# EAGLE design power distribution board (EAGLE 8.3.1)
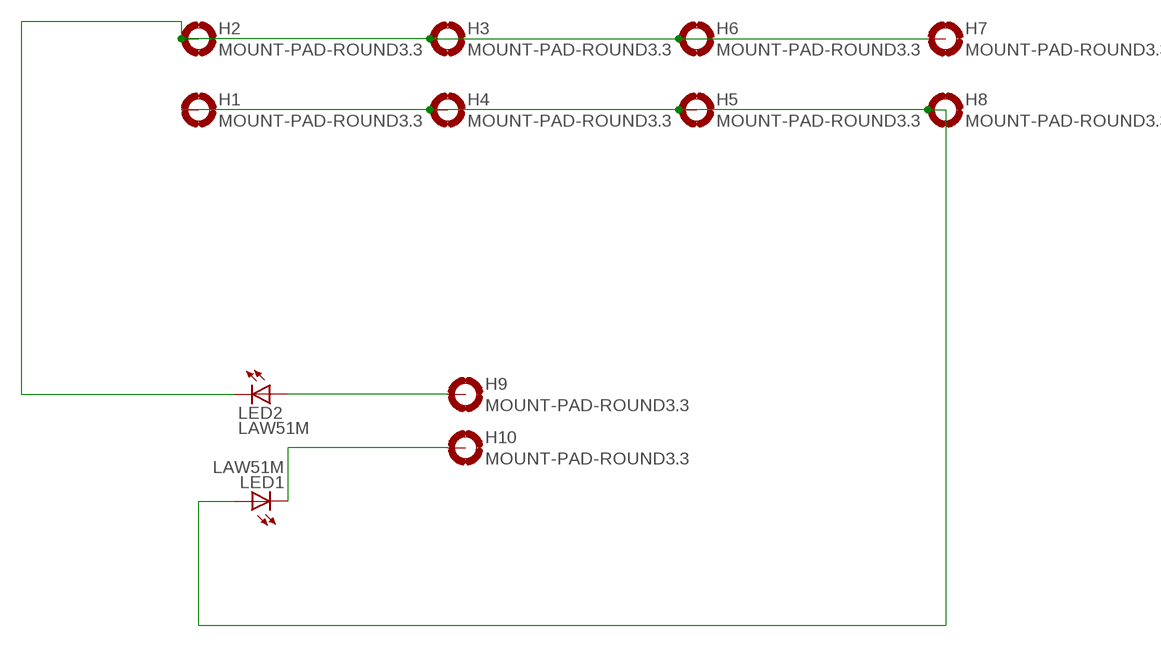
[diagram p0: schematic, sheet 1]

## Parts
H1  MOUNT-PAD-ROUND3.3  [3,3-PAD]
H2  MOUNT-PAD-ROUND3.3  [3,3-PAD]
H3  MOUNT-PAD-ROUND3.3  [3,3-PAD]
H4  MOUNT-PAD-ROUND3.3  [3,3-PAD]
H5  MOUNT-PAD-ROUND3.3  [3,3-PAD]
H6  MOUNT-PAD-ROUND3.3  [3,3-PAD]
H7  MOUNT-PAD-ROUND3.3  [3,3-PAD]
H8  MOUNT-PAD-ROUND3.3  [3,3-PAD]
H9  MOUNT-PAD-ROUND3.3  [3,3-PAD]
H10  MOUNT-PAD-ROUND3.3  [3,3-PAD]
LED1  LAW51M  [W51]
LED2  LAW51M  [W51]

## Nets
+: H2.B3,3(MOUNT) H3.B3,3(MOUNT) H6.B3,3(MOUNT) H7.B3,3(MOUNT) LED2.C
-: H1.B3,3(MOUNT) H4.B3,3(MOUNT) H5.B3,3(MOUNT) H8.B3,3(MOUNT) LED1.A
N$1: H9.B3,3(MOUNT) LED2.A
N$2: H10.B3,3(MOUNT) LED1.C
Unconnected: LED1.TH@1(TH) LED1.TH@2(TH) LED1.TH@3(TH) LED2.TH@1(TH) LED2.TH@2(TH) LED2.TH@3(TH)

## Library data of the parts
H1-H10 = holes:MOUNT-PAD-ROUND: MOUNTING PAD, round
LED1 LED2 = led:*W51M: Golden DRAGON® with Lens Enhanced Thinfilm LED Source: LA_LR_LY_W51M_Pb_free[1].pdf

## Board
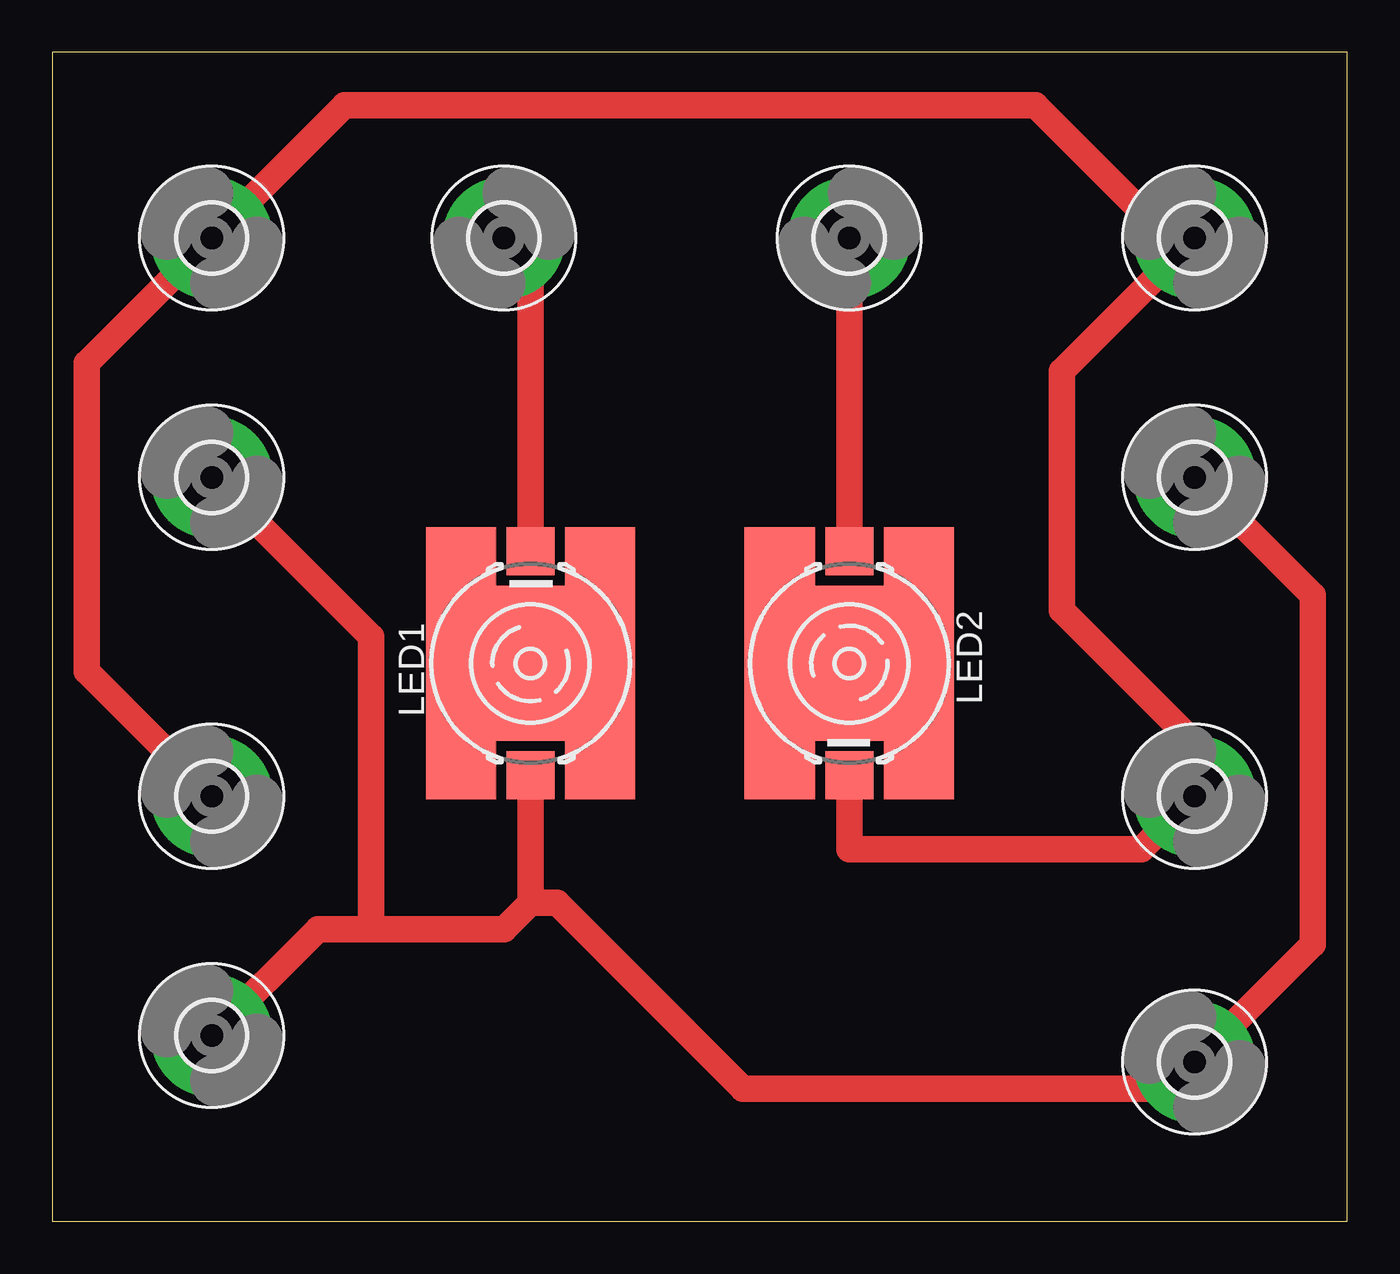
[diagram p1: board, top side]

Size 61.9 x 55.87 mm. Coordinates in mm from the lower left corner, seen from the top.
Outline: 0,0 61.9,0 61.9,55.87 0,55.87 0,0
Copper layers (1*16): Top 0.035mm / dielectric 1.5mm / Bottom 0.035mm
Design rules "default": minimum track width 6mil, minimum drill 0.35mm, track to track 6mil, track to pad 6mil, pad to pad 6mil, via to via 6mil, smd to smd 6mil, copper to edge 40mil, drill to drill 6mil, minimum pad ring 10mil, minimum via ring 8mil, stop-mask expansion 4mil, vias tented up to drill 0mil, thermal gap 10mil

### Footprints (pad centres in the part's own frame; a part is rotated, then mirrored left to right if it is on the bottom)
3,3-PAD = drill 3.3 pad 5.842: B3,3 0,0
W51 = smd 2.3 x 2.3: A -5.35,0; C 5.35,0 | smd 7.4 x 3.4: TH@1 0,0 | smd 13 x 3.35: TH@2 0,3.325; TH@3 0,-3.325

### Placement (x,y rotation side)
H1  7.62,8.89 90 top
H2  7.62,46.99 90 top
H3  54.61,46.99 90 top
H4  7.62,35.56 90 top
H5  54.61,7.62 90 top
H6  54.61,20.32 90 top
H7  7.62,20.32 90 top
H8  54.61,35.56 90 top
H9  38.1,46.99 0 top
H10  21.59,46.99 0 top
LED1  22.86,26.67 90 top
LED2  38.1,26.67 270 top

### Tracks (layer width: path | path; a pad name or v marks a point on that pad's centre or on a via)
+
  Top 1.27: LED2.C 38.1,17.78 52.07,17.78 H6.B3,3 54.61,22.86 48.26,29.21 48.26,40.64 H3.B3,3 53.34,46.99 46.99,53.34 13.97,53.34 H2.B3,3 1.65,41.02 1.65,26.29 H7.B3,3
-
  Top 1.27: LED1.A 22.86,15.24 | 22.86,15.24 21.59,13.97 15.24,13.97 | 15.24,13.97 12.7,13.97 H1.B3,3 | 15.24,13.97 15.24,27.94 H4.B3,3 | 22.86,15.24 24.13,15.24 33.02,6.35 53.34,6.35 H5.B3,3 60.25,13.26 60.25,29.92 H8.B3,3
N$1
  Top 1.27: LED2.A H9.B3,3
N$2
  Top 1.27: LED1.C 22.86,45.72 H10.B3,3